# Altium project Module 22 PCB Routing - Brendan Cook.PrjPcb
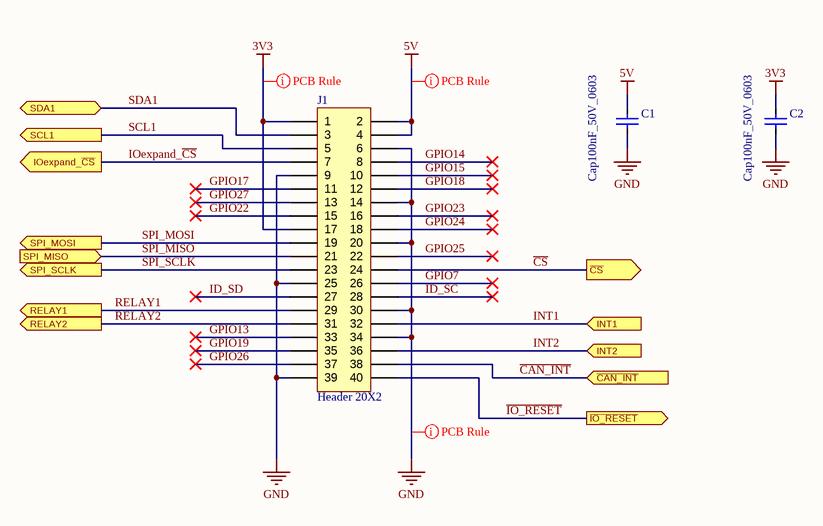
[diagram p0:  Processor_Interface.SchDoc]
 Altium Department: Altium Training Department;  Altium Training: Altium Designer Essentials Training Course - A365;  Altium Training Module: Module [--] / [Title];  CAGE_CODE: -----;  CONTRACT_NUMBER: <CONTRACT NO>;  DOC_NO_ASSY_DWG: <ASSY DWG NO>;  DOC_NO_BOM: <BOM DOC NO>;  DOC_NO_FAB_DWG: <FAB DWG NO>;  DOC_NO_SCH_DWG: <SCH DWG NO>;  DRAFTSMAN_ASSEMBLY_SCALE: 1:1;  DRAFTSMAN_FABRICATION_SCALE: 1:1;  PCB_2_DEC_TOL: +/-.01;  PCB_3_DEC_TOL: +/-.010;  PCB_ANG_TOL: +/-1/2;  PCB_ASSEMBLY_NO: <PCB ASSY NO>;  PCB_CHECKER: - -----;  PCB_CHECKER_APP_DATE: --/--/----;  PCB_DESIGNER: - -----;  PCB_DESIGNER_APP_DATE: --/--/----;  PCB_DWG_NO: A-ET-A365-001;  PCB_ENGINEER: - -----;  PCB_ENGINEER_APP_DATE: --/--/----;  PCB_PART_NUMBER: <PCB PN>;  PCB_REV: 1.0;  PCB_SCALE: NONE;  PCB_TITLE_1: <TITLE 1>;  PCB_TITLE_2: <TITLE 2>;  Project_Name: WC Topping;  SCH_CHECKER: - -----;  SCH_CHECKER_APP_DATE: --/--/----;  SCH_DESIGNER: - -----;  SCH_DESIGNER_APP_DATE: --/--/----;  SCH_ENGINEER: - -----;  SCH_ENGINEER_APP_DATE: --/--/----;  SCH_REV: A
5 sheets, 53 parts. Net scope: flat (ports and power ports of the same name join across sheets).
Board file:  Module 22 PCB Routing.PcbDoc
Sheets:
   Processor_Interface.SchDoc
   CAN_Interface.SchDoc
   Digital_ IO.SchDoc
   Relay_IO.SchDoc
   Power Supply.SchDoc

## Sheet  Processor_Interface.SchDoc
size 431 x 279 mm; Organization: ORGANIZATION; Address1: ADDRESS 1; Address2: ADDRESS 2; Address3: ADDRESS 3; Address4: ADDRESS 4; Revision: -; SheetNumber: 7; SheetTotal: 8; ENG_APP_DATE: --/--/--; DSN_APP_DATE: --/--/--; CHK_APP_DATE: --/--/--

### Parts
C1  Cap100nF_50V_0603  [0603C_L]
C2  Cap100nF_50V_0603  [0603C_L]
J1  Header 20X2  [HDR2X20]

### Ports
INT1 (in), INT2 (in), IOexpand_~{CS} (out), RELAY1 (out), RELAY2 (out), SCL1 (out), SDA1 (bidir), SPI_MISO (in), SPI_MOSI (out), SPI_SCLK (out), ~{CAN_INT} (in), ~{CS} (out), ~{IO_RESET} (out)

### Nets
3V3: C2.2 J1.1 J1.17
5V: C1.2 J1.2 J1.4
GND: C1.1 C2.1 J1.6 J1.9 J1.14 J1.20 J1.25 J1.30 J1.34 J1.39
~{CAN_INT}: J1.38 ; port ~{CAN_INT}
~{IO_RESET}: J1.40 ; port ~{IO_RESET}
~{CS}: J1.24 ; port ~{CS}
GPIO7: J1.26
GPIO13: J1.33
GPIO14: J1.8
GPIO15: J1.10
GPIO17: J1.11
GPIO18: J1.12
GPIO19: J1.35
GPIO22: J1.15
GPIO23: J1.16
GPIO24: J1.18
GPIO25: J1.22
GPIO26: J1.37
GPIO27: J1.13
ID_SC: J1.28
ID_SD: J1.27
INT1: J1.32 ; port INT1
INT2: J1.36 ; port INT2
IOexpand_~{CS}: J1.7 ; port IOexpand_~{CS}
RELAY1: J1.29 ; port RELAY1
RELAY2: J1.31 ; port RELAY2
SCL1: J1.5 ; port SCL1
SDA1: J1.3 ; port SDA1
SPI_MISO: J1.21 ; port SPI_MISO
SPI_MOSI: J1.19 ; port SPI_MOSI
SPI_SCLK: J1.23 ; port SPI_SCLK

### Layout directives
net class Power; rule Width Constraint [Pref Width = 30mil    Min Width = 10mil    Max Width = 100mil]: 3V3, 5V, GND

### Notes on the sheet
- DWG. NO.
- REV.
- SHT.
- THIS DOCUMENT AND THE DATA DISCLOSED HEREIN OR HEREWITH IS THE PROPERTY OF ALTIUM LIMITED AND MAY BE FREELY DISTRIBUTED IN WHOLE. NO RIGHTS ARE RESERVED OR EXPRESS OR IMPLIED WARANTEE GIVEN.
- REVISION
- DESCRIPTION
- DATE
- APPROVED
- ENG:
- DSN:
- APPROVALS
- PROJECT REVISION:
- www.altium.com <http://www.altium.com>
- DOCUMENT REVISION:
- 92037, La Jolla
- USA
- Altium Ltd.
- 4225 Executive Square
- CHK:
- REFERENCE DOCUMENTS
- DESIGN ITEM:
- TITLE
- VARIANT
- BOM:
- FAB DWG:
- PCB DWG:
- ASSY DWG:
- SCALE:
- SIZE
- B
- CAGE CODE
- FILE NAME
- DWG NO.
- SHEET
- OF
- REV

### Library data of the parts
C1 C2 = CMP-00119-2: Ceramic Capacitor, Multilayer, Ceramic, 50V, 80% +Tol, 20% -Tol, Y5V, -82/+22% TC, 0.1uF, Surface Mount, 0603; Value: 100nF; Multilayer: Yes; Packaging: Tape and Reel; Case/Package: 0603; Dielectric Material: Ceramic; Height: 0.8mm; Length: 1.6mm; Max Operating Temperature: 85°C; Min Operating Temperature: -30°C; Mounting Technology: Surface Mount; Pins: 2; RoHS Compliant: Yes; Termination: Wraparound; Voltage Rating: 50V; Width: 0.8mm; Capacitor Type: Ceramic; JESD-609 Code: e3; Package Shape: Rectangular; Package Style: SMTMeter; Rated DC Voltage (URdc): 50V; Reach SVHC Compliant: Yes; Temperature Characteristics Code: Y5V; Terminal Finish: Nickel; Tolerance  (fill in as +-): 20%; Tolerance (fill in as +-): 80%
J1 = CMP-00208-1: Header, 20-Pin, Dual row; LatestRevisionDate: 17-Jul-2002; LatestRevisionNote: Re-released for DXP Platform.; Publisher: Altium Limited; Design Item ID: Header 20X2; Source: WCT.SchLib

## Sheet  CAN_Interface.SchDoc
size 431 x 279 mm; Organization: ORGANIZATION; Address1: ADDRESS 1; Address2: ADDRESS 2; Address3: ADDRESS 3; Address4: ADDRESS 4; Revision: -; SheetNumber: 3; SheetTotal: 8; ENG_APP_DATE: --/--/--; DSN_APP_DATE: --/--/--; CHK_APP_DATE: --/--/--
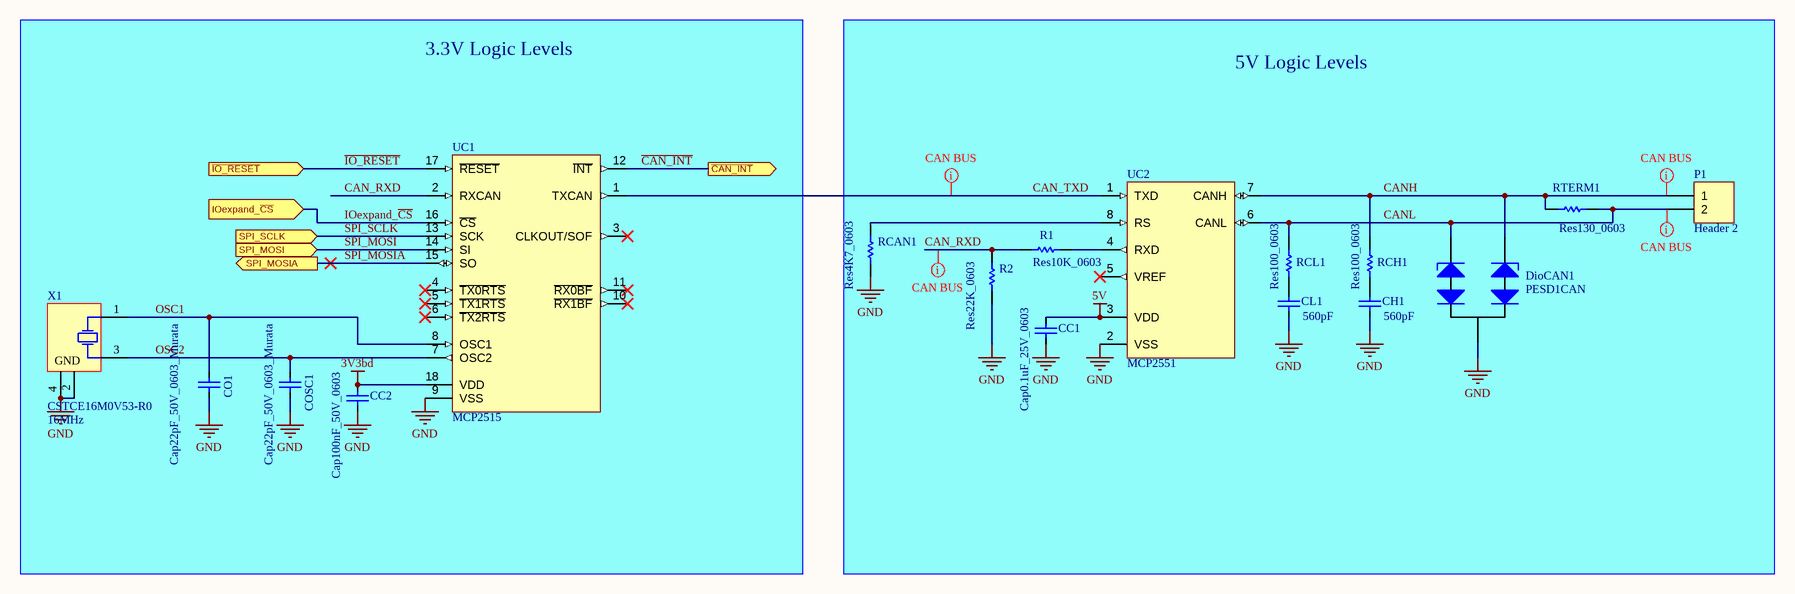
[diagram p1:  CAN_Interface.SchDoc]

### Parts
CC1  Cap0.1uF_25V_0603  [0603C_L]
CC2  Cap100nF_50V_0603  [0603C_L]
CH1  value 560pF  [0603C_L]  (hidden comment: CAP General)
CL1  value 560pF  [0603C_L]  (hidden comment: CAP General)
CO1  Cap22pF_50V_0603_Murata  [0603C_L]
COSC1  Cap22pF_50V_0603_Murata  [0603C_L]
DioCAN1  PESD1CAN  [SOT323]
P1  Header 2  [HDR1X2]
R1  Res10K_0603  [0603_L]
R2  Res22K_0603  [0603_L]
RCAN1  Res4K7_0603  [0603_L]
RCH1  Res100_0603  [0603_L]
RCL1  Res100_0603  [0603_L]
RTERM1  Res130_0603  [0603_L]
UC1  MCP2515  [SOIC-SO18_M]
UC2  MCP2551  [SOIC-SN8_N]
X1  CSTCE16M0V53-R0  Frequency: 16MHz  [FP-ABM8-MFG]

### Blocks framed on the sheet
3.3V Logic Levels: CC2 CO1 COSC1 UC1 X1
5V Logic Levels: CC1 CH1 CL1 DioCAN1 P1 R1 R2 RCAN1 RCH1 RCL1 RTERM1 UC2

### Ports
IOexpand_~{CS} (in), SPI_MOSI (in), SPI_MOSIA (out), SPI_SCLK (in), ~{CAN_INT} (out), ~{IO_RESET} (in)

### Nets
3V3bd: CC2.2 UC1.18(VDD)
5V: CC1.2 UC2.3(VDD)
GND: CC1.1 CC2.1 CH1.2 CL1.1 CO1.1 COSC1.1 DioCAN1.3 R2.1 RCAN1.1 UC1.9(VSS) UC2.2(VSS) X1.2(GND) X1.4(GND)
~{CAN_INT}: UC1.12(~{INT}) ; port ~{CAN_INT}
~{IO_RESET}: UC1.17(~{RESET}) ; port ~{IO_RESET}
CAN_RXD: R1.2 R2.2 UC1.2(RXCAN)
CAN_TXD: UC1.1(TXCAN) UC2.1(TXD)
CANH: DioCAN1.1(A) P1.1 RCH1.2 RTERM1.2 UC2.7(CANH)
CANL: DioCAN1.2(K) P1.2 RCL1.2 RTERM1.1 UC2.6(CANL)
IOexpand_~{CS}: UC1.16(~{CS}) ; port IOexpand_~{CS}
OSC1: CO1.2 UC1.8(OSC1) X1.1
OSC2: COSC1.2 UC1.7(OSC2) X1.3
SPI_MOSI: UC1.14(SI) ; port SPI_MOSI
SPI_MOSIA: UC1.15(SO) ; port SPI_MOSIA
SPI_SCLK: UC1.13(SCK) ; port SPI_SCLK
NetCH1_1: CH1.1 RCH1.1
NetCL1_2: CL1.2 RCL1.1
NetR1_1: R1.1 UC2.4(RXD)
NetRCAN1_2: RCAN1.2 UC2.8(RS)

Not connected (* = marked no-connect by the designer): UC1 3(CLKOUT/SOF)* 4(~{TX0RTS})* 5(~{TX1RTS})* 6(~{TX2RTS})* 10(~{RX1BF})* 11(~{RX0BF})*; UC2 5(VREF)*

### Layout directives
net class CAN_Bus; rule Width Constraint [Pref Width = 20mil    Min Width = 10mil    Max Width = 30mil]; rule Clearance Constraint [Clearance = 15mil]: CAN_RXD, CAN_TXD, CANH, CANL

### Notes on the sheet
- DWG. NO.
- REV.
- SHT.
- THIS DOCUMENT AND THE DATA DISCLOSED HEREIN OR HEREWITH IS THE PROPERTY OF ALTIUM LIMITED AND MAY BE FREELY DISTRIBUTED IN WHOLE. NO RIGHTS ARE RESERVED OR EXPRESS OR IMPLIED WARANTEE GIVEN.
- REVISION
- DESCRIPTION
- DATE
- APPROVED
- ENG:
- DSN:
- APPROVALS
- PROJECT REVISION:
- www.altium.com <http://www.altium.com>
- DOCUMENT REVISION:
- 92037, La Jolla
- USA
- Altium Ltd.
- 4225 Executive Square
- CHK:
- REFERENCE DOCUMENTS
- DESIGN ITEM:
- TITLE
- VARIANT
- BOM:
- FAB DWG:
- PCB DWG:
- ASSY DWG:
- SCALE:
- SIZE
- B
- CAGE CODE
- FILE NAME
- DWG NO.
- SHEET
- OF
- REV

### Library data of the parts
CC1 = CMP-00001-1: Value: 100nF; Voltage Rating: 25V; Case/Package: 0603
CC2 = CMP-00119-2: as C1 on sheet  Processor_Interface; Case/Package: 0603; Dielectric Material: Ceramic; Height: 0.8mm; Length: 1.6mm; Max Operating Temperature: 85°C; Min Operating Temperature: -30°C; Mounting Technology: Surface Mount; Packaging: Tape and Reel; Pins: 2; RoHS Compliant: Yes; Termination: Wraparound; Voltage Rating: 50V; Width: 0.8mm; Capacitor Type: Ceramic; JESD-609 Code: e3; Package Shape: Rectangular; Package Style: SMTMeter; Rated DC Voltage (URdc): 50V; Reach SVHC Compliant: Yes; Temperature Characteristics Code: Y5V; Terminal Finish: Nickel; Tolerance  (fill in as +-): 20%; Tolerance (fill in as +-): 80%
CH1 CL1 = CMP-00212-1: 560pF 25V 0603; Case/Package: 0603; Voltage Rating: 25V
CO1 COSC1 = CMP-00026-1: Ceramic Capacitor, Multilayer, Ceramic, 50V, 5% +Tol, 5% -Tol, C0G, 30ppm/Cel TC, 0.000022uF, Surface Mount, 0603; Value: 22pF; Multilayer: Yes; Case/Package: 0603; Pins: 2; Min Operating Temperature: -55°C; Max Operating Temperature: 125°C; Voltage Rating: 50V; Tolerance: 5%; Packaging: Tape and Reel; Length: 1.6mm; Height: 0.8mm; Width: 0.8mm; Dielectric Material: Ceramic; Mounting Technology: Surface Mount; RoHS Compliant: Yes; Termination: Wraparound; Capacitor Type: Ceramic; JESD-609 Code: e3; Package Shape: Rectangular; Package Style: SMTMeter; Rated DC Voltage (URdc): 50V; Reach SVHC Compliant: Yes; Temperature Characteristics Code: C0G; Terminal Finish: Nickel; Tolerance  (fill in as +-): 5%; Tolerance (fill in as +-): 5%
DioCAN1 = CMP-00244-2: Trans Voltage Suppressor Diode, 150W, 24V V(RWM), Bidirectional, 2 Element, Silicon; Manufacturer: Nexperia USA Inc.; Diode Type: Fast Recovery; Design Item ID: PESD1CAN-UX; Source: WCT.SchLib
P1 = CMP-00146-1: Header, 2-Pin; LatestRevisionDate: 17-Jul-2002; LatestRevisionNote: Re-released for DXP Platform.; Publisher: Altium Limited; Design Item ID: Header 2; Source: WCT.SchLib
R1 = CMP-00098-1: Manufacturer: Panasonic Electronic Components; Manufacturer Part Number: ERJ-3GEYJ102V; Resistance (Ohms): 10k; Tolerance: 5%; Power (Watts): 0.1W, 1/10W; Temperature Coefficient: ±200ppm/°C; RoHS: RoHS Compliant; Category: Resistors; Packaging: Cut Tape (CT); Part Status: Active; Composition: Thick Film; Features: Automotive AEC-Q200; Operating Temperature: -55°C ~ 155°C; Package / Case: 0603 (1608 Metric); Supplier Device Package: 0603; Size / Dimension: 0.063" L x 0.031" W (1.60mm x 0.80mm); Height: 0.022" (0.55mm); Number of Terminations: 2; Failure Rate: -; Design Item ID: Res10K_0603; Source: WCT.SchLib
R2 = CMP-00013-1: RES22K 0.5% 0603; Manufacturer: Yageo; Manufacturer Part Number: RT0603DRD0722KL; Power Rating: 100 mW; Temperature Coefficient: 25 PPM / C; Voltage Rating: 75V; Unit Weight: 0.000071 oz; Value: 22k; Stock 1: 39729; Pricing 1: 1=0.12, 10=0.104, 25=0.0716, 50=0.0558, 100=0.0399, 250=0.0311, 500=0.0247, 1000=0.0175 (USD); Product Category: Thin Film Resistors - SMD; RoHS: True; Tolerance: 0.5%; Case Code - mm: 1608; Operating Temperature Range: - 55 C to + 125 C; Series: RT; Packaging: Reel; Brand: Yageo; Height: 0.45 mm; Length: 1.6 mm; Package / Case: 0603 (1608 metric); Product: Thin Film Resistors SMD; Termination Style: SMD/SMT; Type: High Precision, High Stability; Width: 0.8 mm; ComponentLink1URL: https://datasheet.ciiva.com/12810/pyu-rt-1-to-0-05-rohs-l-4-12810773.pdf; ComponentLink1Description: https://datasheet.ciiva.com/12810/pyu-rt-1-to-0-05-rohs-l-4-12810773.pdf; Case/Package: 0603; Design Item ID: Res22K_0603; Source: WCT.SchLib
RCAN1 = CMP-00016-1: Manufacturer: Yageo; Resistance (Ohms): 4.7k; Tolerance: 0.5%; Power (Watts): 0.1W, 1/10W; Temperature Coefficient: ±25ppm/°C; RoHS: RoHS Compliant; Category: Resistors; Stock 1: 28874; Pricing 1: 1=0.22, 10=0.184, 25=0.134, 100=0.0721, 250=0.05532, 500=0.04358, 1000=0.03018, 2500=0.02766 (USD); Packaging: Cut Tape (CT); Part Status: Active; Composition: Thin Film; Features: Moisture Resistant; Operating Temperature: -55°C ~ 155°C; Package / Case: 0603 (1608 Metric); Supplier Device Package: 0603; Size / Dimension: 0.063" L x 0.031" W (1.60mm x 0.80mm); Height: 0.022" (0.55mm); Number of Terminations: 2; Failure Rate: -; ComponentLink1URL: http://www.yageo.com/documents/recent/PYu-RT_1-to-0.05_RoHS_L_6.pdf; ComponentLink1Description: http://www.yageo.com/documents/recent/PYu-RT_1-to-0.05_RoHS_L_6.pdf; Design Item ID: Res4K7_0603; Source: WCT.SchLib
RCH1 RCL1 = CMP-00096-1: Manufacturer: Panasonic Electronic Components; Resistance (Ohms): 100; Tolerance: 5%; Power (Watts): 0.1W, 1/10W; Temperature Coefficient: ±200ppm/°C; RoHS: RoHS Compliant; Category: Resistors; Stock 1: 1335381; Pricing 1: 1=0.1, 50=0.0096, 100=0.0071, 250=0.00544, 500=0.00436, 1000=0.00321 (USD); Packaging: Cut Tape (CT); Part Status: Active; Composition: Thick Film; Features: Automotive AEC-Q200; Operating Temperature: -55°C ~ 155°C; Package / Case: 0603 (1608 Metric); Supplier Device Package: 0603; Size / Dimension: 0.063" L x 0.031" W (1.60mm x 0.80mm); Height: 0.022" (0.55mm); Number of Terminations: 2; Failure Rate: -; ComponentLink1URL: http://industrial.panasonic.com/www-cgi/jvcr13pz.cgi?E+PZ+3+AOA0001+ERJ3GEYJ102V+7+WW; ComponentLink1Description: http://industrial.panasonic.com/www-cgi/jvcr13pz.cgi?E+PZ+3+AOA0001+ERJ3GEYJ102V+7+WW; Design Item ID: Res100_0603; Source: WCT.SchLib
RTERM1 = CMP-00199-1: Manufacturer: Panasonic Electronic Components; Resistance (Ohms): 100; Tolerance: 5%; Power (Watts): 0.1W, 1/10W; Temperature Coefficient: ±200ppm/°C; RoHS: RoHS Compliant; Category: Resistors; Stock 1: 1335381; Pricing 1: 1=0.1, 50=0.0096, 100=0.0071, 250=0.00544, 500=0.00436, 1000=0.00321 (USD); Packaging: Cut Tape (CT); Part Status: Active; Composition: Thick Film; Features: Automotive AEC-Q200; Operating Temperature: -55°C ~ 155°C; Package / Case: 0603 (1608 Metric); Supplier Device Package: 0603; Size / Dimension: 0.063" L x 0.031" W (1.60mm x 0.80mm); Height: 0.022" (0.55mm); Number of Terminations: 2; Failure Rate: -; ComponentLink1URL: http://industrial.panasonic.com/www-cgi/jvcr13pz.cgi?E+PZ+3+AOA0001+ERJ3GEYJ102V+7+WW; ComponentLink1Description: http://industrial.panasonic.com/www-cgi/jvcr13pz.cgi?E+PZ+3+AOA0001+ERJ3GEYJ102V+7+WW; Design Item ID: Res130_0603; Source: WCT.SchLib
UC1 = CMP-00190-1: Stand-Alone CAN Controller With SPI Interface, 18-Pin SOIC, Extended Temperature; Manufacturer: Microchip; Manufacturer Part Number: MCP2515-E/SO; Available Preview Images: 2D; RevisionNote: URLs added. DatasheetVersion updated.; DatasheetVersion: revF, Oct-2010; ComponentLink2Description: Datasheet; ComponentLink3Description: Package Specification; ComponentLink1Description: Manufacturer URL; PackageReference: SOIC-SO18; PackageDescription: 18-Lead Plastic Small Outline (SO) - Wide 7.50mm Body [SOIC]; PackageVersion: revBB, Aug-2009; ComponentLink1URL: http://www.microchip.com/; ComponentLink3URL: http://www.microchip.com/stellent/groups/techpub_sg/documents/packagingspec/en012702.pdf; ComponentLink2URL: http://ww1.microchip.com/downloads/en/DeviceDoc/21801f.pdf; Code_JEDEC: MS-013; Design Item ID: MCP2515-E/SO; Source: WCT.SchLib
UC2 = CMP-00229-1: High-Speed CAN Transceiver, 8-Pin SOIC, Extended Temperature; Manufacturer: Microchip; Manufacturer Part Number: MCP2551-E/SN; Available Preview Images: 2D; PackageReference: SOIC-SN8; Code_JEDEC: MS-012; ComponentLink1Description: Manufacturer URL; ComponentLink1URL: http://www.microchip.com/; PackageVersion: revBB, Aug-2009; ComponentLink3Description: Package Specification; Code_IPC: SOIC127P600-8; ComponentLink2URL: http://ww1.microchip.com/downloads/en/DeviceDoc/21667F.pdf; RevisionNote: URLs added. DatasheetVersion updated.; ComponentLink3URL: http://www.microchip.com/stellent/groups/techpub_sg/documents/packagingspec/en012702.pdf; DatasheetVersion: revF, Jul-2010; ComponentLink2Description: Datasheet; PackageDescription: 8-Lead Plastic Small Outline (SN) - Narrow, 3.90mm Body [SOIC]; Design Item ID: MCP2551-E/SN; Source: WCT.SchLib
X1 = CMP-00010-2: Crystal 16MHz ±20ppm 18pF SMD-4 3.2mm x 2.5mm CSTCE16M0V53-R0 ABM8-16.000MHZ-B2-T; Frequency Stability: 50ppm; Series Resistance: 70R; ESR (Equivalent Series Resistance): 70; Termination: SMD/SMT; REACH SVHC: No SVHC; Lead Free: Lead Free; Package Quantity: 1000; Tolerance: 20ppm; Design Item ID: ABM8-16.000MHZ-B2-T; Depth: 2.5mm; Operating Frequency: 16MHz; Radiation Hardening: No; Min Operating Temperature: -20°C; Pins: 4; Source: WCT.SchLib; Resistor Type: Ceramic; RoHS Compliant: Yes; Height: 0.031inch; Frequency Tolerance: 20ppm; Case/Package: CSMD; Packaging: Tape and Reel; Series: ABM8; Length: 3.2mm; Load Capacitance: 18pF; Mount: Surface Mount; Width: 2.5mm; Max Operating Temperature: 70°C

## Sheet  Digital_ IO.SchDoc
size 431 x 279 mm; Organization: ORGANIZATION; Address1: ADDRESS 1; Address2: ADDRESS 2; Address3: ADDRESS 3; Address4: ADDRESS 4; Revision: -; SheetNumber: 4; SheetTotal: 8; ENG_APP_DATE: --/--/--; DSN_APP_DATE: --/--/--; CHK_APP_DATE: --/--/--
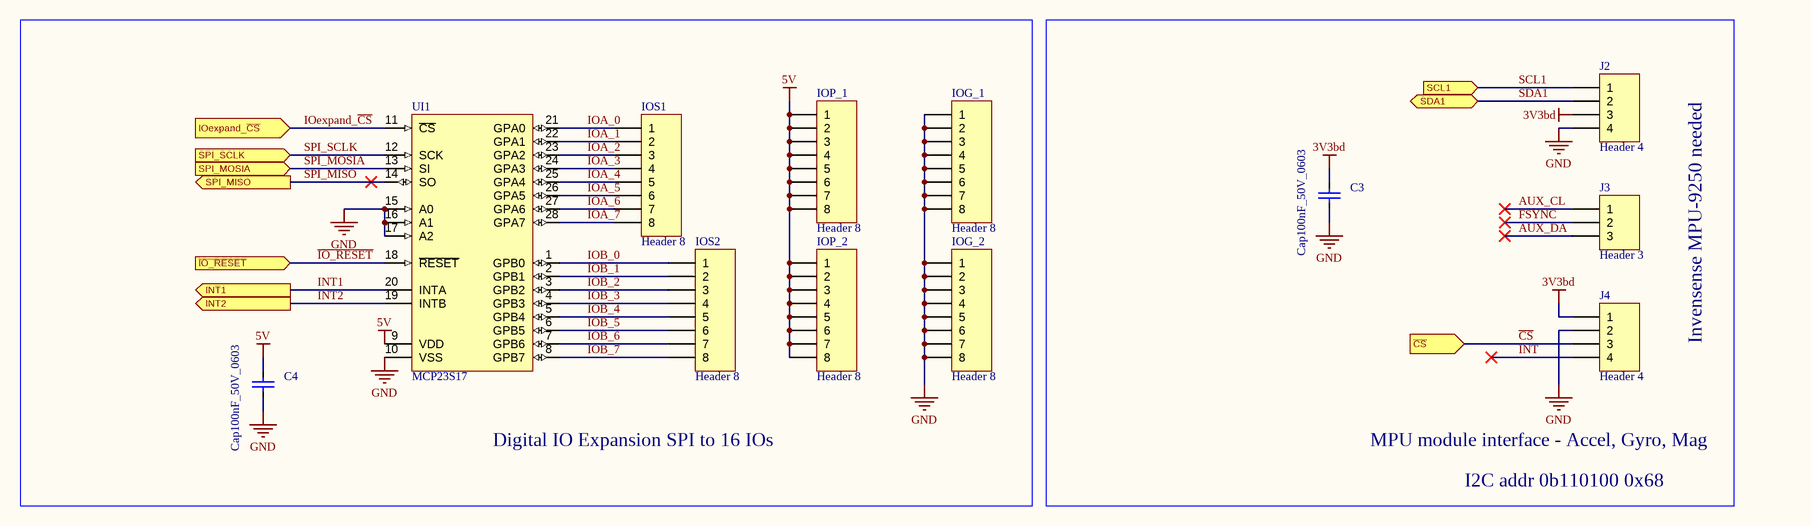
[diagram p2:  Digital_ IO.SchDoc]

### Parts
C3  Cap100nF_50V_0603  [0603C_L]
C4  Cap100nF_50V_0603  [0603C_L]
IOG_1  Header 8  [HDR1X8]
IOG_2  Header 8  [HDR1X8]
IOP_1  Header 8  [HDR1X8]
IOP_2  Header 8  [HDR1X8]
IOS1  Header 8  [HDR1X8]
IOS2  Header 8  [HDR1X8]
J2  Header 4  [HDR1X4]
J3  Header 3  [HDR1X3]
J4  Header 4  [HDR1X4]
UI1  MCP23S17  [SOIC-SO28_L]

### Blocks framed on the sheet
Digital IO Expansion SPI to 16 IOs: C4 IOG_1 IOG_2 IOP_1 IOP_2 IOS1 IOS2 UI1

### Ports
INT1 (out), INT2 (out), IOexpand_~{CS} (in), SCL1 (in), SDA1 (bidir), SPI_MISO (out), SPI_MOSIA (in), SPI_SCLK (in), ~{CS} (in), ~{IO_RESET} (in)

### Nets
3V3bd: C3.2 J2.3 J4.1
5V: C4.2 IOP_1.1 IOP_1.2 IOP_1.3 IOP_1.4 IOP_1.5 IOP_1.6 IOP_1.7 IOP_1.8 IOP_2.1 IOP_2.2 IOP_2.3 IOP_2.4 IOP_2.5 IOP_2.6 IOP_2.7 IOP_2.8 UI1.9(VDD)
GND: C3.1 C4.1 IOG_1.1 IOG_1.2 IOG_1.3 IOG_1.4 IOG_1.5 IOG_1.6 IOG_1.7 IOG_1.8 IOG_2.1 IOG_2.2 IOG_2.3 IOG_2.4 IOG_2.5 IOG_2.6 IOG_2.7 IOG_2.8 J2.4 J4.2 UI1.10(VSS) UI1.15(A0) UI1.16(A1) UI1.17(A2)
~{IO_RESET}: UI1.18(~{RESET}) ; port ~{IO_RESET}
AUX_CL: J3.1
AUX_DA: J3.3
~{CS}: J4.3 ; port ~{CS}
FSYNC: J3.2
INT: J4.4
INT1: UI1.20(INTA) ; port INT1
INT2: UI1.19(INTB) ; port INT2
IOA_0: IOS1.1 UI1.21(GPA0)
IOA_1: IOS1.2 UI1.22(GPA1)
IOA_2: IOS1.3 UI1.23(GPA2)
IOA_3: IOS1.4 UI1.24(GPA3)
IOA_4: IOS1.5 UI1.25(GPA4)
IOA_5: IOS1.6 UI1.26(GPA5)
IOA_6: IOS1.7 UI1.27(GPA6)
IOA_7: IOS1.8 UI1.28(GPA7)
IOB_0: IOS2.1 UI1.1(GPB0)
IOB_1: IOS2.2 UI1.2(GPB1)
IOB_2: IOS2.3 UI1.3(GPB2)
IOB_3: IOS2.4 UI1.4(GPB3)
IOB_4: IOS2.5 UI1.5(GPB4)
IOB_5: IOS2.6 UI1.6(GPB5)
IOB_6: IOS2.7 UI1.7(GPB6)
IOB_7: IOS2.8 UI1.8(GPB7)
IOexpand_~{CS}: UI1.11(~{CS}) ; port IOexpand_~{CS}
SCL1: J2.1 ; port SCL1
SDA1: J2.2 ; port SDA1
SPI_MISO: UI1.14(SO) ; port SPI_MISO
SPI_MOSIA: UI1.13(SI) ; port SPI_MOSIA
SPI_SCLK: UI1.12(SCK) ; port SPI_SCLK

### Notes on the sheet
- Invensense MPU-9250 needed
- MPU module interface - Accel, Gyro, Mag
- I2C addr 0b110100 0x68
- DWG. NO.
- REV.
- SHT.
- THIS DOCUMENT AND THE DATA DISCLOSED HEREIN OR HEREWITH IS THE PROPERTY OF ALTIUM LIMITED AND MAY BE FREELY DISTRIBUTED IN WHOLE. NO RIGHTS ARE RESERVED OR EXPRESS OR IMPLIED WARANTEE GIVEN.
- REVISION
- DESCRIPTION
- DATE
- APPROVED
- ENG:
- DSN:
- APPROVALS
- PROJECT REVISION:
- www.altium.com <http://www.altium.com>
- DOCUMENT REVISION:
- 92037, La Jolla
- USA
- Altium Ltd.
- 4225 Executive Square
- CHK:
- REFERENCE DOCUMENTS
- DESIGN ITEM:
- TITLE
- VARIANT
- BOM:
- FAB DWG:
- PCB DWG:
- ASSY DWG:
- SCALE:
- SIZE
- B
- CAGE CODE
- FILE NAME
- DWG NO.
- SHEET
- OF
- REV

### Library data of the parts
C3 C4 = CMP-00119-2: as C1 on sheet  Processor_Interface; Packaging: Tape and Reel; Case/Package: 0603; Dielectric Material: Ceramic; Height: 0.8mm; Length: 1.6mm; Max Operating Temperature: 85°C; Min Operating Temperature: -30°C; Mounting Technology: Surface Mount; Pins: 2; RoHS Compliant: Yes; Termination: Wraparound; Voltage Rating: 50V; Width: 0.8mm; Capacitor Type: Ceramic; JESD-609 Code: e3; Package Shape: Rectangular; Package Style: SMTMeter; Rated DC Voltage (URdc): 50V; Reach SVHC Compliant: Yes; Temperature Characteristics Code: Y5V; Terminal Finish: Nickel; Tolerance  (fill in as +-): 20%; Tolerance (fill in as +-): 80%
IOG_1 IOG_2 IOP_1 IOP_2 IOS1 IOS2 = CMP-00206-1: Header, 8-Pin; LatestRevisionDate: 17-Jul-2002; LatestRevisionNote: Re-released for DXP Platform.; Publisher: Altium Limited; Design Item ID: Header 8; Source: WCT.SchLib
J2 J4 = CMP-00175-1: Header, 4-Pin; LatestRevisionDate: 17-Jul-2002; LatestRevisionNote: Re-released for DXP Platform.; Publisher: Altium Limited; Design Item ID: Header 4; Source: WCT.SchLib
J3 = CMP-00151-1: Header, 3-Pin; LatestRevisionDate: 17-Jul-2002; LatestRevisionNote: Re-released for DXP Platform.; Publisher: Altium Limited; Design Item ID: Header 3; Source: WCT.SchLib
UI1 = CMP-00187-1: 16-Bit I/O Expander with Serial Interface, 28-Pin SOIC, Extended Temperature, Tape and Reel; Manufacturer: Microchip; Manufacturer Part Number: MCP23S17T-E/SO; Available Preview Images: 2D; PackageDescription: 28-Lead Plastic Small Outline (SO) - Wide 7.50mm Body [SOIC]; ComponentLink1URL: http://www.microchip.com/; Code_JEDEC: MS-013; ComponentLink3URL: http://www.microchip.com/stellent/groups/techpub_sg/documents/packagingspec/en012702.pdf; DatasheetVersion: revB, Feb-2007; ComponentLink2URL: http://ww1.microchip.com/downloads/en/DeviceDoc/21952b.pdf; ComponentLink2Description: Datasheet; ComponentLink3Description: Package Specification; PackageReference: SOIC-SO28; RevisionNote: URLs added. Sch pin type corrected.; ComponentLink1Description: Manufacturer URL; PackageVersion: revBB, Aug-2009; Design Item ID: MCP23S17T-E/SO; Source: WCT.SchLib

## Sheet  Relay_IO.SchDoc
size 431 x 279 mm; Organization: ORGANIZATION; Address1: ADDRESS 1; Address2: ADDRESS 2; Address3: ADDRESS 3; Address4: ADDRESS 4; Revision: -; SheetNumber: 5; SheetTotal: 8; ENG_APP_DATE: --/--/--; DSN_APP_DATE: --/--/--; CHK_APP_DATE: --/--/--
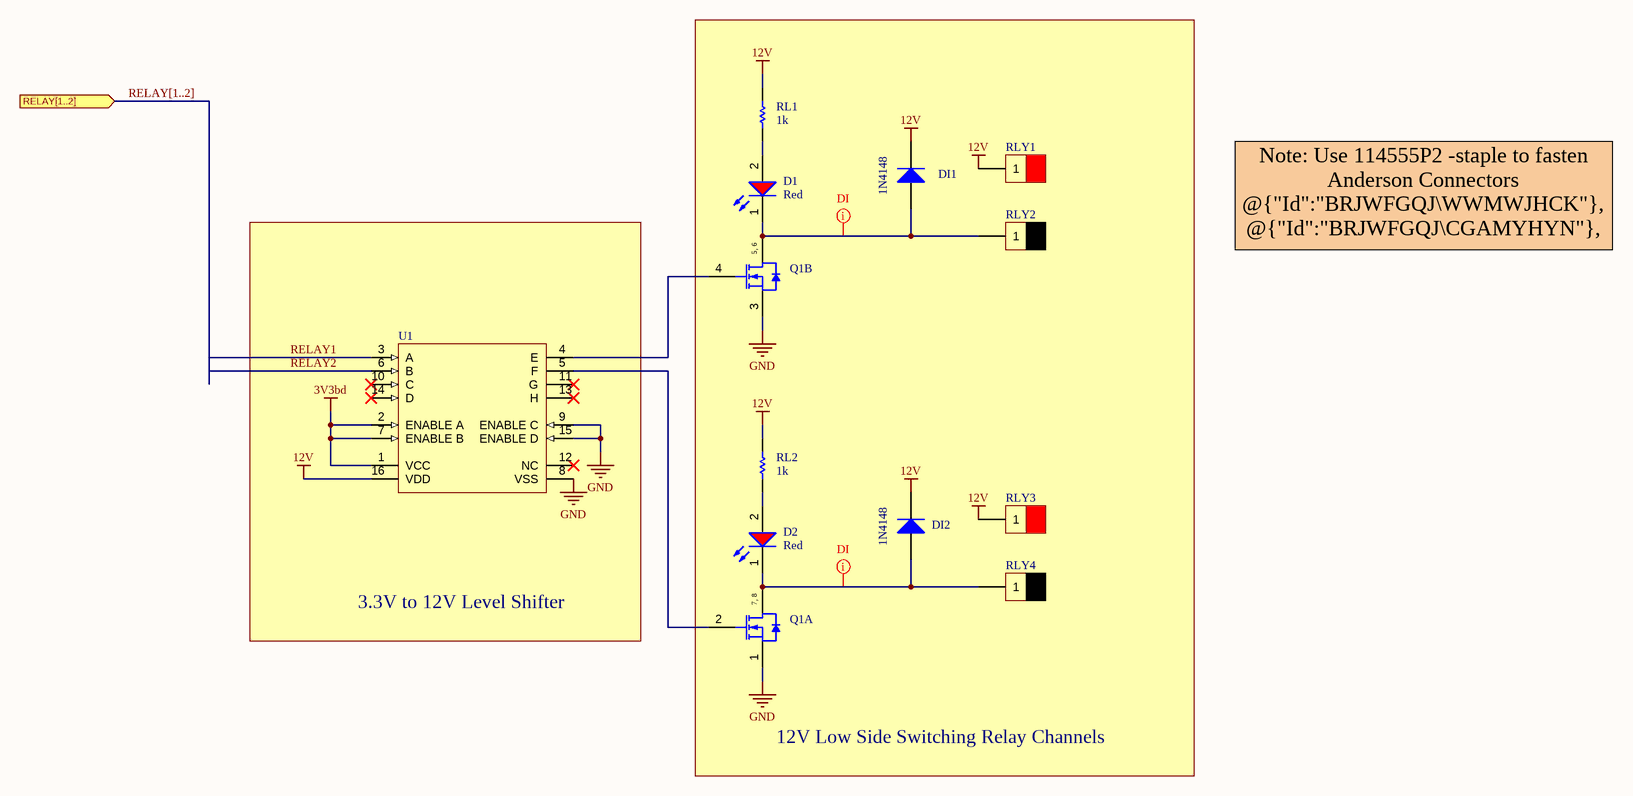
[diagram p3:  Relay_IO.SchDoc]

### Parts
D1  Color: Red  [0603_A]  (hidden comment: LED_Red0603)
D2  Color: Red  [0603_A]  (hidden comment: LED_Red0603)
DI1  1N4148  [DO-41]
DI2  1N4148  [DO-41]
Q1  NTHD4508NT1  [ONSC-CHIPFET-8-1206A-03_S2_V]  (value not drawn)  (parts A,B of 2)
RL1  Resistance (Ohms): 1k  [0805_L]  (hidden comment: Res1K_0805)
RL2  Resistance (Ohms): 1k  [0805_L]  (hidden comment: Res1K_0805)
RLY1  Anderson-1Pin RED_PCB_RHT  [Anderson_RED_RHT_BOT]  (value not drawn)
RLY2  Anderson-1Pin BLK_PCB_RHT  [Anderson_BLK_RHT_BOT]  (value not drawn)
RLY3  Anderson-1Pin RED_PCB_RHT  [Anderson_RED_RHT_BOT]  (value not drawn)
RLY4  Anderson-1Pin BLK_PCB_RHT  [Anderson_BLK_RHT_BOT]  (value not drawn)
U1  CD40109BPW  [PW0016A_M]  (value not drawn)

### Blocks framed on the sheet
12V Low Side Switching Relay Channels: D1 D2 DI1 DI2 Q1 RL1 RL2 RLY1-RLY4
3.3V to 12V Level Shifter: U1

### Ports
RELAY[1..2] (in)

### Nets
3V3bd: U1.1(VCC) U1.2(ENABLE_A) U1.7(ENABLE_B)
12V: DI1.2(K) DI2.2(K) RL1.2 RL2.2 RLY1.1 RLY3.1 U1.16(VDD)
GND: Q1.1(S1) Q1.3(S2) U1.8(VSS) U1.9(ENABLE_C) U1.15(ENABLE_D)
RELAY1: U1.3(A)
RELAY2: U1.6(B)
NetD1_1: D1.1(K) DI1.1(A) Q1.5(D2) Q1.6(D2) RLY2.1
NetD1_2: D1.2(A) RL1.1
NetD2_1: D2.1(K) DI2.1(A) Q1.7(D1) Q1.8(D1) RLY4.1
NetD2_2: D2.2(A) RL2.1
NetQ1_2: Q1.2(G1) U1.5(F)
NetQ1_4: Q1.4(G2) U1.4(E)

Not connected (* = marked no-connect by the designer): U1 10(C)* 11(G)* 12(NC)* 13(H)* 14(D)*

### Buses and harness runs
bus RELAY[1..2] = port RELAY[1..2]

### Layout directives
net class DI: NetD1_1, NetD2_1

### Notes on the sheet
- Note: Use 114555P2 -staple to fasten Anderson Connectors @{"Id":"BRJWFGQJ\WWMWJHCK"}, @{"Id":"BRJWFGQJ\CGAMYHYN"}, @{"Id":"BRJWFGQJ\JTIKQCLS"}, @{"Id":"BRJWFGQJ\XEGXROSF"}  to PCB
- DWG. NO.
- REV.
- SHT.
- THIS DOCUMENT AND THE DATA DISCLOSED HEREIN OR HEREWITH IS THE PROPERTY OF ALTIUM LIMITED AND MAY BE FREELY DISTRIBUTED IN WHOLE. NO RIGHTS ARE RESERVED OR EXPRESS OR IMPLIED WARANTEE GIVEN.
- REVISION
- DESCRIPTION
- DATE
- APPROVED
- ENG:
- DSN:
- APPROVALS
- PROJECT REVISION:
- www.altium.com <http://www.altium.com>
- DOCUMENT REVISION:
- 92037, La Jolla
- USA
- Altium Ltd.
- 4225 Executive Square
- CHK:
- REFERENCE DOCUMENTS
- DESIGN ITEM:
- TITLE
- VARIANT
- BOM:
- FAB DWG:
- PCB DWG:
- ASSY DWG:
- SCALE:
- SIZE
- B
- CAGE CODE
- FILE NAME
- DWG NO.
- SHEET
- OF
- REV

### Library data of the parts
D1 D2 = CMP-007-00000-1: Single Color LED, Red, Water Clear, 1.1mm; Viewing Angle: 140°; Overall Height: 0.7mm; Luminous Intensity-Nom: 250mcd; Forward Voltage: 2V; Forward Current: 30mA; Shape: Rectangular; Case/Package: 0603; Mounting Technology: Surface Mount; Pins: 2; Max Operating Temperature: 85°C; Colour: RED; Min Operating Temperature: -40°C; RoHS Compliant: Yes; Size: 1.1mm; Optoelectronic Device Type: SINGLE COLOR LED; Lens Style: WATER CLEAR; Terminal Pitch: 1.6mm
DI1 DI2 = CMP-00241-2: Rectifier Diode, 1 Phase, 1 Element, 1A, 100V V(RRM), Silicon, DO-41; Time @ Peak Reflow Temperature-Max (s): 40s; Package Body Material: Plastic; Reverse Recovery Time-Max: 0.035us; Surface Mount: No; Case Connection: Isolated; Max Surge Current: 35A; Number of Elements: 1; Qualification Status: Not Qualified; Additional Feature: FREE WHEELING DIODE; Forward Voltage: 875mV; Diode Type: RECTIFIER; Rep Pk Reverse Voltage-Max: 100V; Package Shape: Round; JEDEC-95 Code: DO-41; RoHS Compliant: Yes; Package Style: LONG FORMMeter; Peak Reflow Temperature (Cel): 260°C; Max Output current: 1A; Diode Element Material: SILICON; JESD-609 Code: e3; Forward Current: 1A; Case/Package: DO-41; Terminal Position: AXIAL; Pins: 2; Mounting Technology: TH; Max Operating Temperature: 175°C; Terminal Finish: Tin; Terminal Form: Wire; Reach SVHC Compliant: No; JESD-30 Code: O-PALF-W2; Peak Inverse Voltage: 100V; Min Operating Temperature: -65°C
Q1 = CMP-013-00000-2: Small Signal Field-Effect Transistor; Vgs(th) (Max) @ Id: 1.2V @ 250µA; Drain Current-Max (Abs) (ID): 3.1A; Pulsed Drain Current-Max (IDM): 10A; Polarity/Channel Type: N-CHANNEL; Time @ Peak Reflow Temperature-Max (s): 30s; FET Technology: METAL-OXIDE SEMICONDUCTOR; Qualification Status: Not Qualified; Transistor Element Material: SILICON; Power Dissipation-Max (Abs): 1.13W; Drain-source On Resistance-Max: 75mR; Operating Mode: ENHANCEMENT MODE; Transistor Application: SWITCHING; DS Breakdown Voltage-Min: 20V; Number of Elements: 2; Mounting Technology: Surface Mount; Package Shape: Rectangular; Moisture Sensitivity Level: 1; Max Operating Temperature: 150°C; RoHS Compliant: No; Terminal Form: C BEND; Surface Mount: Yes; JESD-609 Code: e0; Terminal Finish: Tin; Package Style: SMALL OUTLINEMeter; Peak Reflow Temperature (Cel): 240°C; Reach SVHC Compliant: No; Pins: 8; Terminal Position: DUAL; Drain Current-Max (ID): 3.1A
RL1 RL2 = CMP-00124-1: Manufacturer: Panasonic Electronic Components; Manufacturer Part Number: ERJ-6GEYJ102V; Tolerance: 5%; Power (Watts): 0.125W, 1/8W; Temperature Coefficient: ±200ppm/°C; RoHS: RoHS Compliant; Category: Resistors; Stock 1: 1669380; Pricing 1: 1=0.1, 50=0.015, 100=0.011, 250=0.0084, 500=0.00674, 1000=0.00496 (USD); Packaging: Cut Tape (CT); Part Status: Active; Composition: Thick Film; Features: Automotive AEC-Q200; Operating Temperature: -55°C ~ 155°C; Package / Case: 0805 (2012 Metric); Supplier Device Package: 0805; Size / Dimension: 0.079" L x 0.049" W (2.00mm x 1.25mm); Height: 0.028" (0.70mm); Number of Terminations: 2; Failure Rate: -; ComponentLink1URL: http://industrial.panasonic.com/www-cgi/jvcr13pz.cgi?E+PZ+3+AOA0001+ERJ6GEYJ102V+7+WW; ComponentLink1Description: http://industrial.panasonic.com/www-cgi/jvcr13pz.cgi?E+PZ+3+AOA0001+ERJ6GEYJ102V+7+WW; Design Item ID: Res1K_0805; Source: WCT.SchLib
RLY1 RLY3 = CMP-00162-3: Connector Accessory, Contact, Copper Alloy; Also Needed Part Nr !!!: 1327; Voltage Rating: 600V; Current Rating: 25A; Also Needed Description!!!: Blade Type Power Housing Connector; Approvals: ULV; Design Use: Power; DIN Conformance: No; Connector Support Type: CONNECTOR ACCESSORY; IEC Conformance: No; Material: Copper Alloy; Max Operating Temperature: 105°C; MIL Conformance: No; Min Operating Temperature: -20°C; Mounting Style: RIGHT ANGLE; Reach SVHC Compliant: Yes; RoHS Compliant: Yes; Terminal Length: 0.29inch; Termination: Solder; Voltage Rating (AC): 600V; Voltage Rating (DC): 600V
RLY2 RLY4 = CMP-00198-1: Connector Accessory, Contact, Copper Alloy; Also Needed Part Nr !!!: 1327G6; Voltage Rating: 600V; Current Rating: 25A; Also Needed Description!!!: Blade Type Power Housing Connector; Approvals: ULV; Design Use: Power; DIN Conformance: No; Max Operating Temperature: 105°C; Min Operating Temperature: -20°C; RoHS Compliant: Yes; Connector Support Type: CONNECTOR ACCESSORY; IEC Conformance: No; Material: Copper Alloy; MIL Conformance: No; Mounting Style: RIGHT ANGLE; Reach SVHC Compliant: Yes; Terminal Length: 0.29inch; Termination: Solder; Voltage Rating (AC): 600V; Voltage Rating (DC): 600V
U1 = CMP-027-000000-1: CMOS Quad Low-to-High Voltage Level Shifter, 3 to 18 V, -55 to 125 degC, 16-Pin TSSOP (PW16), RoHS, Tube; Manufacturer: Texas Instruments; Manufacturer Part Number: CD40109BPWR; Number of Bits: 4; VSS: 3 to 18 V; Propagation Delay: 240 ns Max.; Logic Function: Level Shifter, 3-State; Number of Outputs/Channel: 1; Propagation Delay (Max): 240ns; Voltage - Supply: 3 V ~ 18 V; Dynamic Catalog: 4000B; Other Names: 296-12163-6; Available Preview Images: 2D; Differential - Input:Output: No/No; Logic Type: BUS DRIVER; Max Supply Voltage: 18V; Min Supply Voltage: 3V; Nominal Supply Voltage: 5V; Number of Ports: 2; Output Characteristics: 3-STATE; Output Polarity: True; Package Body Material: Plastic; Propagation Delay (tpd): 600ns; Qualification Status: Not Qualified; PackageDescription: 16-Pin Plastic Small Outline Package, Body 5 x 4.4 mm, Pitch 0.65 mm; ComponentLink3URL: http://www.ti.com/lit/ml/mpds361/mpds361.pdf; Package Reference: PW0016A; ComponentLink2URL: http://www.ti.com/lit/ds/symlink/cd40109b.pdf; RoHS: TRUE; ComponentLink1URL: www.ti.com; ComponentLink1Description: Manufacturer URL; PackageVersion: 4040064-4/G; Number of Channels: 4; PartNumber: CD40109BPW; DatasheetVersion: SCHS099B; Number of Outputs: 4; ComponentLink3Description: Package Specification; ComponentLink2Description: Datasheet; Mounting Technology: Surface Mount; Packing: Tube; Temperature Range: -55 to 125 degC; Stock 1: 11025; Pricing 1: 1=0.42, 10=0.36, 100=0.2688, 500=0.2111, 1000=0.1628 (USD); Standard Package: 1; Category: Integrated Circuits (ICs); Family: Logic - Translators; Series: 4000B; Input Type: Voltage; Output Type: Voltage; Data Rate: -; Operating Temperature: -55°C ~ 125°C; Package / Case: 16-TSSOP (0.173", 4.40mm Width); Supplier Device Package: 16-TSSOP; Packaging: Digi-Reel®; ComponentLink4URL: https://datasheet.ciiva.com/1899/cd40109b-1899236.pdf; ComponentLink4Description: https://datasheet.ciiva.com/1899/cd40109b-1899236.pdf; ComponentLink5URL: https://datasheet.ciiva.com/1899/cd40109b-1899237.pdf; ComponentLink5Description: https://datasheet.ciiva.com/1899/cd40109b-1899237.pdf; ComponentLink6URL: https://datasheet.ciiva.com/1899/cd40109b-1899238.pdf; ComponentLink6Description: https://datasheet.ciiva.com/1899/cd40109b-1899238.pdf; ComponentLink7URL: https://datasheet.ciiva.com/15096/getdatasheetpartid-50246-15096137.pdf; ComponentLink7Description: https://datasheet.ciiva.com/15096/getdatasheetpartid-50246-15096137.pdf; ComponentLink8URL: https://datasheet.ciiva.com/41455/001015415-da-01-en-ic-quad-lo-hi-v-cd40109bpwr-tssop-16-tid-41455340.pdf; ComponentLink8Description: https://datasheet.ciiva.com/41455/001015415-da-01-en-ic-quad-lo-hi-v-cd40109bpwr-tssop-16-tid-41455340.pdf; ComponentLink9URL: https://datasheet.ciiva.com/3305/cd40109b-mil-3305133.pdf; ComponentLink9Description: https://datasheet.ciiva.com/3305/cd40109b-mil-3305133.pdf; Design Item ID: CD40109BPW; Source: WCT.SchLib; Case/Package: TSSOP; Max Operating Temperature: 125°C; Min Operating Temperature: -55°C; Pins: 16; RoHS Compliant: Yes; Height - Seated (Max): 1.2mm; JESD-30 Code: R-PDSO-G16; JESD-609 Code: e4; Length: 5mm; Moisture Sensitivity Level: 1; Channels: 1; Package Shape: Rectangular; Package Style: SMALL OUTLINE, THIN PROFILE, SHRINK PITCHMeter; Peak Reflow Temperature (Cel): 260°C; Reach SVHC Compliant: Yes; Surface Mount: Yes; Technology: CMOS; Temperature Grade: MILITARY; Terminal Finish: Nickel; Terminal Form: Gull Wing; Terminal Pitch: 0.65mm; Terminal Position: DUAL; Width: 4.4mm

## Sheet  Power Supply.SchDoc
size 431 x 279 mm; Organization: ORGANIZATION; Address1: ADDRESS 1; Address2: ADDRESS 2; Address3: ADDRESS 3; Address4: ADDRESS 4; Revision: -; SheetNumber: 8; SheetTotal: 8; ENG_APP_DATE: --/--/--; DSN_APP_DATE: --/--/--; CHK_APP_DATE: --/--/--
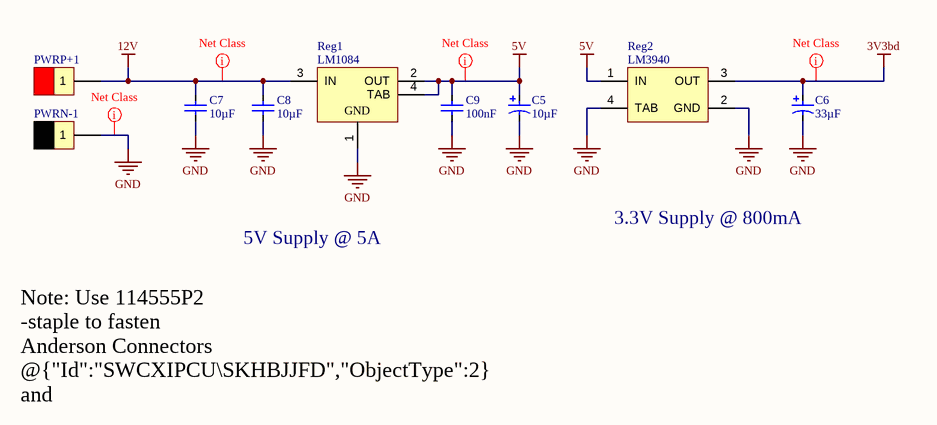
[diagram p4:  Power Supply.SchDoc]

### Parts
C5  value 10µF  [AVX-TPSB106K020R1000_L]  (hidden comment: TPSB106K020R1000)
C6  value 33µF  [FP-TAJY-MFG]  (hidden comment: TAJY336K020RNJ)
C7  value 10µF  [CAPC2013X135X45ML10T25]  (hidden comment: CAP_Murata)
C8  value 10µF  [CAPC2013X135X45ML10T25]  (hidden comment: CAP_Murata)
C9  value 100nF  [0603C_L]  (hidden comment: Cap100nF_50V_0603)
PWRN-1  Anderson-1Pin BLK_PCB_RHT  [Anderson_BLK_RHT_BOT]  (value not drawn)
PWRP+1  Anderson-1Pin RED_PCB_RHT  [Anderson_RED_RHT_BOT]  (value not drawn)
Reg1  LM1084  [KTT0003B_L]
Reg2  LM3940  [SOT223]

### Nets
3V3bd: C6.2 Reg2.3(OUT)
5V: C5.2 C9.2 Reg1.2(OUT) Reg1.4(TAB) Reg2.1(IN)
12V: C7.2 C8.2 PWRP+1.1 Reg1.3(IN)
GND: C5.1 C6.1 C7.1 C8.1 C9.1 PWRN-1.1 Reg1.1(GND) Reg2.2(GND) Reg2.4(TAB)

### Layout directives
net class PowerNets: 3V3bd, 5V, 12V, GND

### Notes on the sheet
- 5V Supply @ 5A
- 3.3V Supply @ 800mA
- Note: Use 114555P2 -staple to fasten Anderson Connectors @{"Id":"SWCXIPCU\SKHBJJFD","ObjectType":2} and @{"Id":"SWCXIPCU\CMMJLNMH","ObjectType":2}
- DWG. NO.
- REV.
- SHT.
- THIS DOCUMENT AND THE DATA DISCLOSED HEREIN OR HEREWITH IS THE PROPERTY OF ALTIUM LIMITED AND MAY BE FREELY DISTRIBUTED IN WHOLE. NO RIGHTS ARE RESERVED OR EXPRESS OR IMPLIED WARANTEE GIVEN.
- REVISION
- DESCRIPTION
- DATE
- APPROVED
- ENG:
- DSN:
- APPROVALS
- PROJECT REVISION:
- www.altium.com <http://www.altium.com>
- DOCUMENT REVISION:
- 92037, La Jolla
- USA
- Altium Ltd.
- 4225 Executive Square
- CHK:
- REFERENCE DOCUMENTS
- DESIGN ITEM:
- TITLE
- VARIANT
- BOM:
- FAB DWG:
- PCB DWG:
- ASSY DWG:
- SCALE:
- SIZE
- B
- CAGE CODE
- FILE NAME
- DWG NO.
- SHEET
- OF
- REV

### Library data of the parts
C5 = CMP-00072-1: Tantalum Capacitor, Polarized, Tantalum (dry/solid), 20V, 10% +Tol, 10% -Tol, 10uF, Surface Mount, 1210; ESR (Equivalent Series Resistance): 1R; Leakage Current: 2uA; Tan Delta: 0.06; Polarity: Polarized; JESD-609 Code: e3; Pins: 2; RoHS Compliant: Yes; Max Operating Temperature: 125°C; Package Style: SMTMeter; Height: 1.9mm; Termination: J BEND; Tolerance (fill in as +-): 10%; Reach SVHC Compliant: Yes; Rated DC Voltage (URdc): 20V; Package Shape: Rectangular; Min Operating Temperature: -55°C; Terminal Finish: Nickel; Packaging: Tape and Reel; Width: 2.8mm; Dielectric Material: Tantalum; Tolerance  (fill in as +-): 10%; Mounting Technology: Surface Mount; Capacitor Type: Tantalum; Case/Package: 1411; Length: 3.5mm
C6 = CMP-00012-1: Tantalum Capacitor, Polarized, Tantalum (dry/solid), 20V, 10% +Tol, 10% -Tol, 33uF, Surface Mount, 2917; Tan Delta: 0.06; ESR (Equivalent Series Resistance): 600mR; Leakage Current: 6.6uA; Max Operating Temperature: 125°C; Package Shape: Rectangular; Tolerance (fill in as +-): 10%; Rated DC Voltage (URdc): 20V; Height: 2mm; Case/Package: 2917; Packaging: Tape and Reel; Polarity: Polarized; JESD-609 Code: e3; Termination: J BEND; Tolerance  (fill in as +-): 10%; Terminal Finish: Nickel; Pins: 2; Length: 7.3mm; Width: 4.3mm; Dielectric Material: Tantalum; Min Operating Temperature: -55°C; Capacitor Type: Tantalum; Package Style: SMTMeter; Mounting Technology: Surface Mount; RoHS Compliant: Yes; Reach SVHC Compliant: Yes
C7 C8 = CMP-00043-1: Ceramic Capacitor, Multilayer, Ceramic, 25V, 10% +Tol, 10% -Tol, X5R, 15% TC, 10uF, Surface Mount, 0805; Tolerance: 10%; Case/Package: 0805; Max Operating Temperature: 85°C; Min Operating Temperature: -55°C; Mounting Technology: Surface Mount; Pins: 2; RoHS Compliant: Yes; Capacitor Type: Ceramic
C9 = CMP-00119-2: Ceramic Capacitor, Multilayer, Ceramic, 50V, 80% +Tol, 20% -Tol, Y5V, -82/+22% TC, 0.1uF, Surface Mount, 0603; Multilayer: Yes; Packaging: Tape and Reel; Case/Package: 0603; Dielectric Material: Ceramic; Height: 0.8mm; Length: 1.6mm; Max Operating Temperature: 85°C; Min Operating Temperature: -30°C; Mounting Technology: Surface Mount; Pins: 2; RoHS Compliant: Yes; Termination: Wraparound; Voltage Rating: 50V; Width: 0.8mm; Capacitor Type: Ceramic; JESD-609 Code: e3; Package Shape: Rectangular; Package Style: SMTMeter; Rated DC Voltage (URdc): 50V; Reach SVHC Compliant: Yes; Temperature Characteristics Code: Y5V; Terminal Finish: Nickel; Tolerance  (fill in as +-): 20%; Tolerance (fill in as +-): 80%
PWRN-1 = CMP-00198-1: as RLY2 on sheet  Relay_IO; Max Operating Temperature: 105°C; Min Operating Temperature: -20°C; RoHS Compliant: Yes; Connector Support Type: CONNECTOR ACCESSORY; IEC Conformance: No; Material: Copper Alloy; MIL Conformance: No; Mounting Style: RIGHT ANGLE; Reach SVHC Compliant: Yes; Terminal Length: 0.29inch; Termination: Solder; Voltage Rating (AC): 600V; Voltage Rating (DC): 600V
PWRP+1 = CMP-00162-3: as RLY1 on sheet  Relay_IO; Connector Support Type: CONNECTOR ACCESSORY; IEC Conformance: No; Material: Copper Alloy; Max Operating Temperature: 105°C; MIL Conformance: No; Min Operating Temperature: -20°C; Mounting Style: RIGHT ANGLE; Reach SVHC Compliant: Yes; RoHS Compliant: Yes; Terminal Length: 0.29inch; Termination: Solder; Voltage Rating (AC): 600V; Voltage Rating (DC): 600V
Reg1 = CMP-00188-1: 5A Low Dropout Positive Regulators, 3-pin TO-263, Pb-Free; Manufacturer: Texas Instruments; PartNumber: LM1084IS-5.0/NOPB; PowerWise: N; PackageTopMarking: NSUZXYTTE#*LM1084*IS-5.0; High-Reliability: Y; CompType: LDO IC; Available Preview Images: 2D; ComponentLink1Description: Datasheet URL; PackageDescription: TO-263, Molded, .400 x .390 x .180in, 3 Lead, .1in Pitch, Surface Mount; RoHS: Y; PackageReference: KTT0003B; PinCount: 3; Code_JEDEC: MO-169-AA; ComponentLink1URL: http://www.ti.com/general/docs/lit/getliterature.tsp?genericPartNumber=LM1084&fileType=pdf; Manufacturer Part Number: LM1084IS-5.0/NOPB; Design Item ID: LM1084; Source: WCT.SchLib
Reg2 = CMP-00091-1: 1A Low Dropout Regulator for 5V to 3.3V Conversion, 4-pin SOT-223, Pb-Free; Manufacturer: Texas Instruments; Manufacturer Part Number: LM3940IMP-3.3/NOPB; PowerWise: N; CompType: LDO IC; PackageTopMarking: XYTT*L52B; Voltage Regulator Type: LDO; Regulator Output Type: Fixed; Polarity Type: Positive; Number of Outputs: 1; Input Voltage (Min): 4.5V; Input Voltage: 7.5V; Load Regulation: 50mV; Line Regulation: 40mV; Dropout Voltage@Current (Typ): 0.5@1A/0.11@100mA; Quiescent Current (Max): 15mA; PackageDescription: Molded SOT-223, 6.50 x 3.56 x 1.6mm Body, 4 Lead, 2.3mm Pitch; ComponentLink1URL: http://www.ti.com/general/docs/lit/getliterature.tsp?genericPartNumber=LM3940&fileType=pdf; PackageReference: DCY0004A; RoHS: Y; ComponentLink1Description: Datasheet URL; PinCount: 4; Code_JEDEC: TO-261-AA; Code_IPC: SOT223-4; Stock 1: 22816; Pricing 1: 1=1.49, 10=1.332, 100=1.0381, 500=0.8585 (USD); Topology: LDO; Output Voltage: 3.3V; Package Type: SOT-223; Packaging: Tape and Reel; Output Current: 1A; Operating Temp Range: -40C to 125C; Operating Temperature Classification: Automotive; Pin Count: 3 +Tab; Mounting: Surface Mount; ComponentLink2URL: https://datasheet.ciiva.com/48433/elnatsemico-spanungsregler-ldo-lm3940-en-48433415.pdf; ComponentLink2Description: https://datasheet.ciiva.com/48433/elnatsemico-spanungsregler-ldo-lm3940-en-48433415.pdf; ComponentLink3URL: https://datasheet.ciiva.com/49046/1896170-49046286.pdf; ComponentLink3Description: https://datasheet.ciiva.com/49046/1896170-49046286.pdf; ComponentLink4URL: https://datasheet.ciiva.com/46384/1882650-46384431.pdf; ComponentLink4Description: https://datasheet.ciiva.com/46384/1882650-46384431.pdf; Design Item ID: LM3940IMP-3.3/NOPB; Source: WCT.SchLib

## Nets that join several sheets
3V3bd:  CAN_Interface (CC2.2 UC1.18),  Digital_ IO (C3.2 J2.3 J4.1),  Relay_IO (U1.1 U1.2 U1.7),  Power Supply (C6.2 Reg2.3)
5V:  Processor_Interface (C1.2 J1.2 J1.4),  CAN_Interface (CC1.2 UC2.3),  Digital_ IO (18 pins),  Power Supply (5 pins)
12V:  Relay_IO (7 pins),  Power Supply (C7.2 C8.2 PWRP+1.1 Reg1.3)
GND:  Processor_Interface (10 pins),  CAN_Interface (13 pins),  Digital_ IO (24 pins),  Relay_IO (5 pins),  Power Supply (9 pins)
~{CAN_INT}:  Processor_Interface (J1.38),  CAN_Interface (UC1.12)
~{IO_RESET}:  Processor_Interface (J1.40),  CAN_Interface (UC1.17),  Digital_ IO (UI1.18)
~{CS}:  Processor_Interface (J1.24),  Digital_ IO (J4.3)
INT1:  Processor_Interface (J1.32),  Digital_ IO (UI1.20)
INT2:  Processor_Interface (J1.36),  Digital_ IO (UI1.19)
IOexpand_~{CS}:  Processor_Interface (J1.7),  CAN_Interface (UC1.16),  Digital_ IO (UI1.11)
SCL1:  Processor_Interface (J1.5),  Digital_ IO (J2.1)
SDA1:  Processor_Interface (J1.3),  Digital_ IO (J2.2)
SPI_MISO:  Processor_Interface (J1.21),  Digital_ IO (UI1.14)
SPI_MOSI:  Processor_Interface (J1.19),  CAN_Interface (UC1.14)
SPI_MOSIA:  CAN_Interface (UC1.15),  Digital_ IO (UI1.13)
SPI_SCLK:  Processor_Interface (J1.23),  CAN_Interface (UC1.13),  Digital_ IO (UI1.12)